# EAGLE schematic Thunderbread2 (EAGLE 7.6.0)
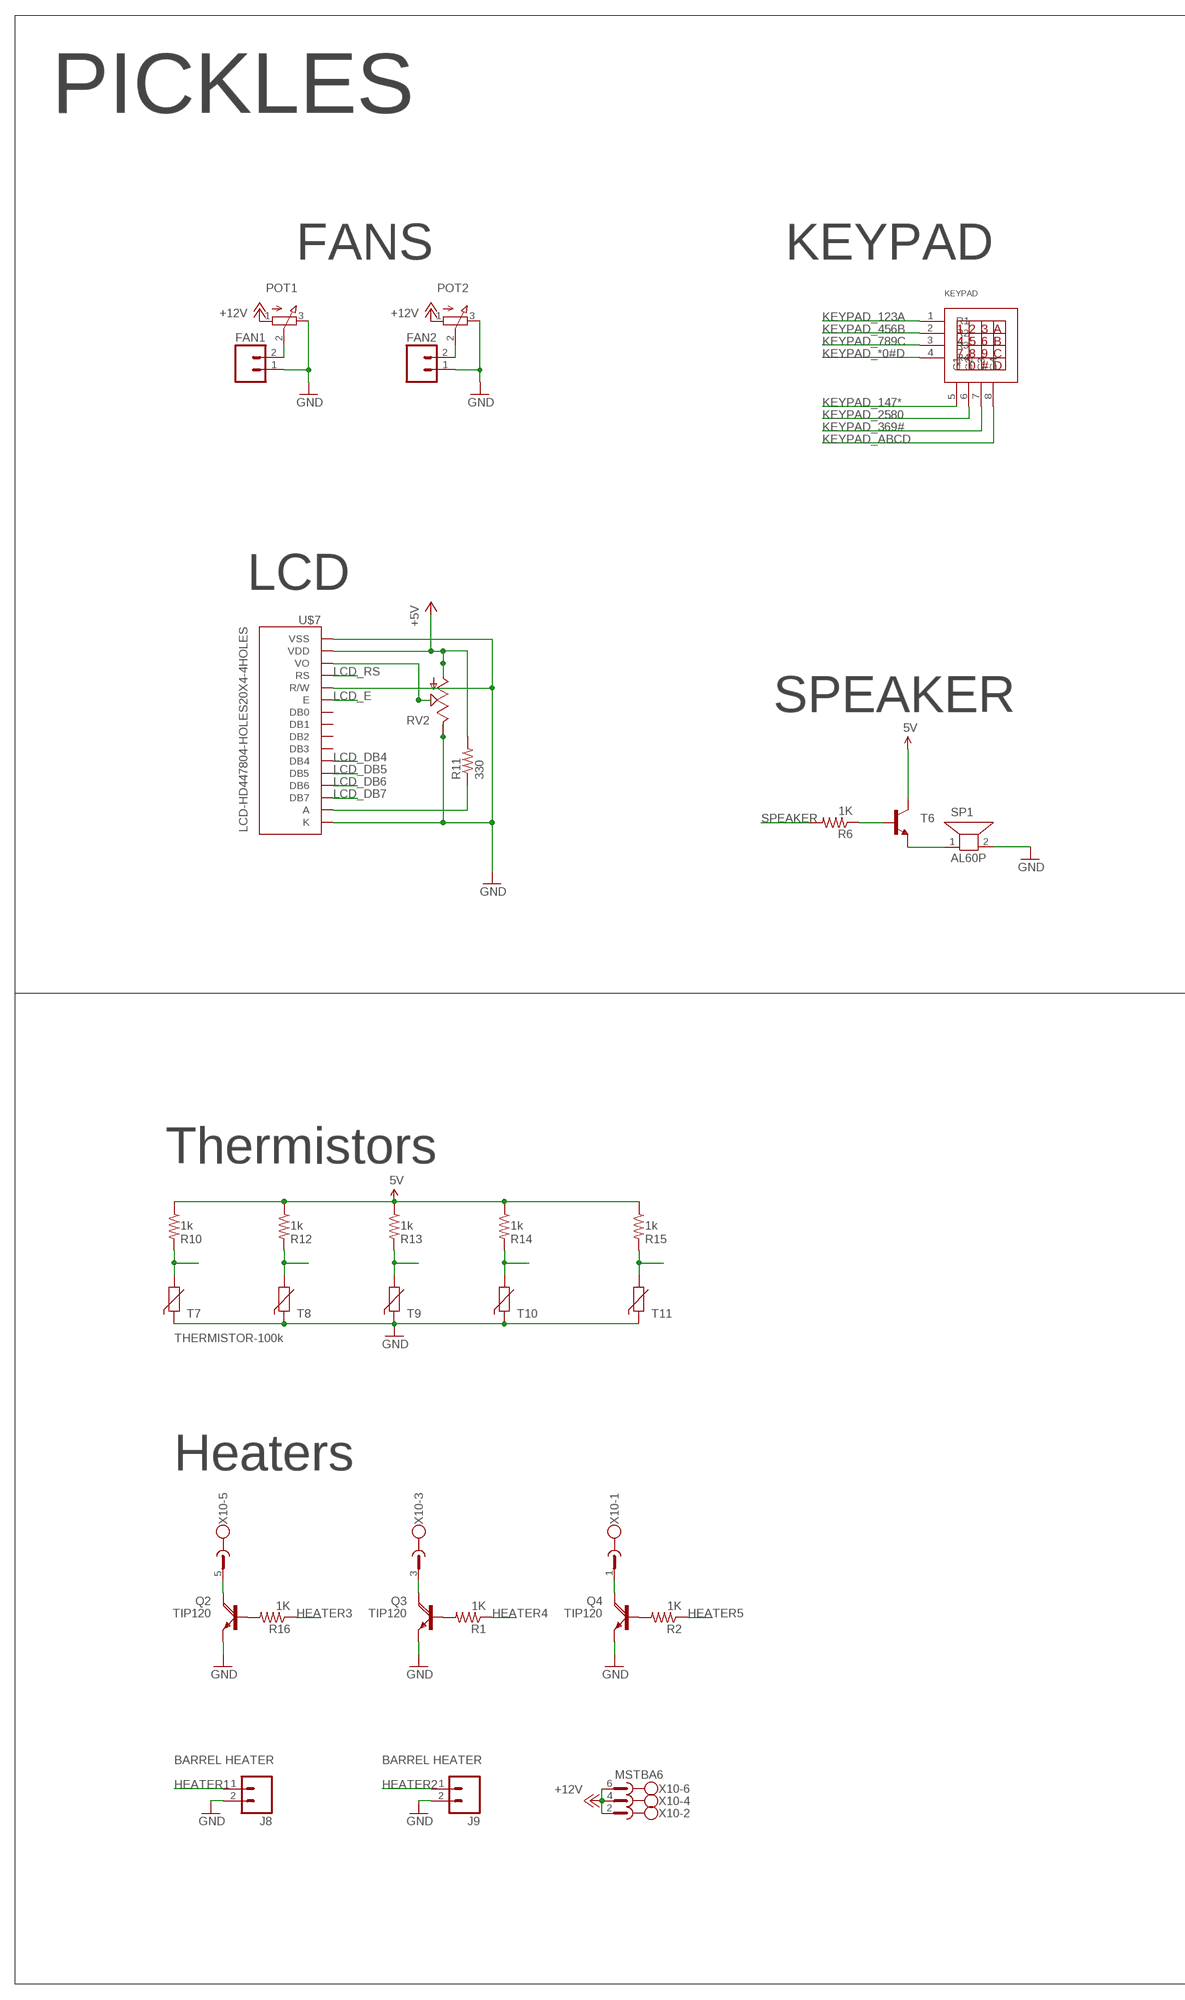
[diagram p0: schematic, sheet 1, part 1 of 3]
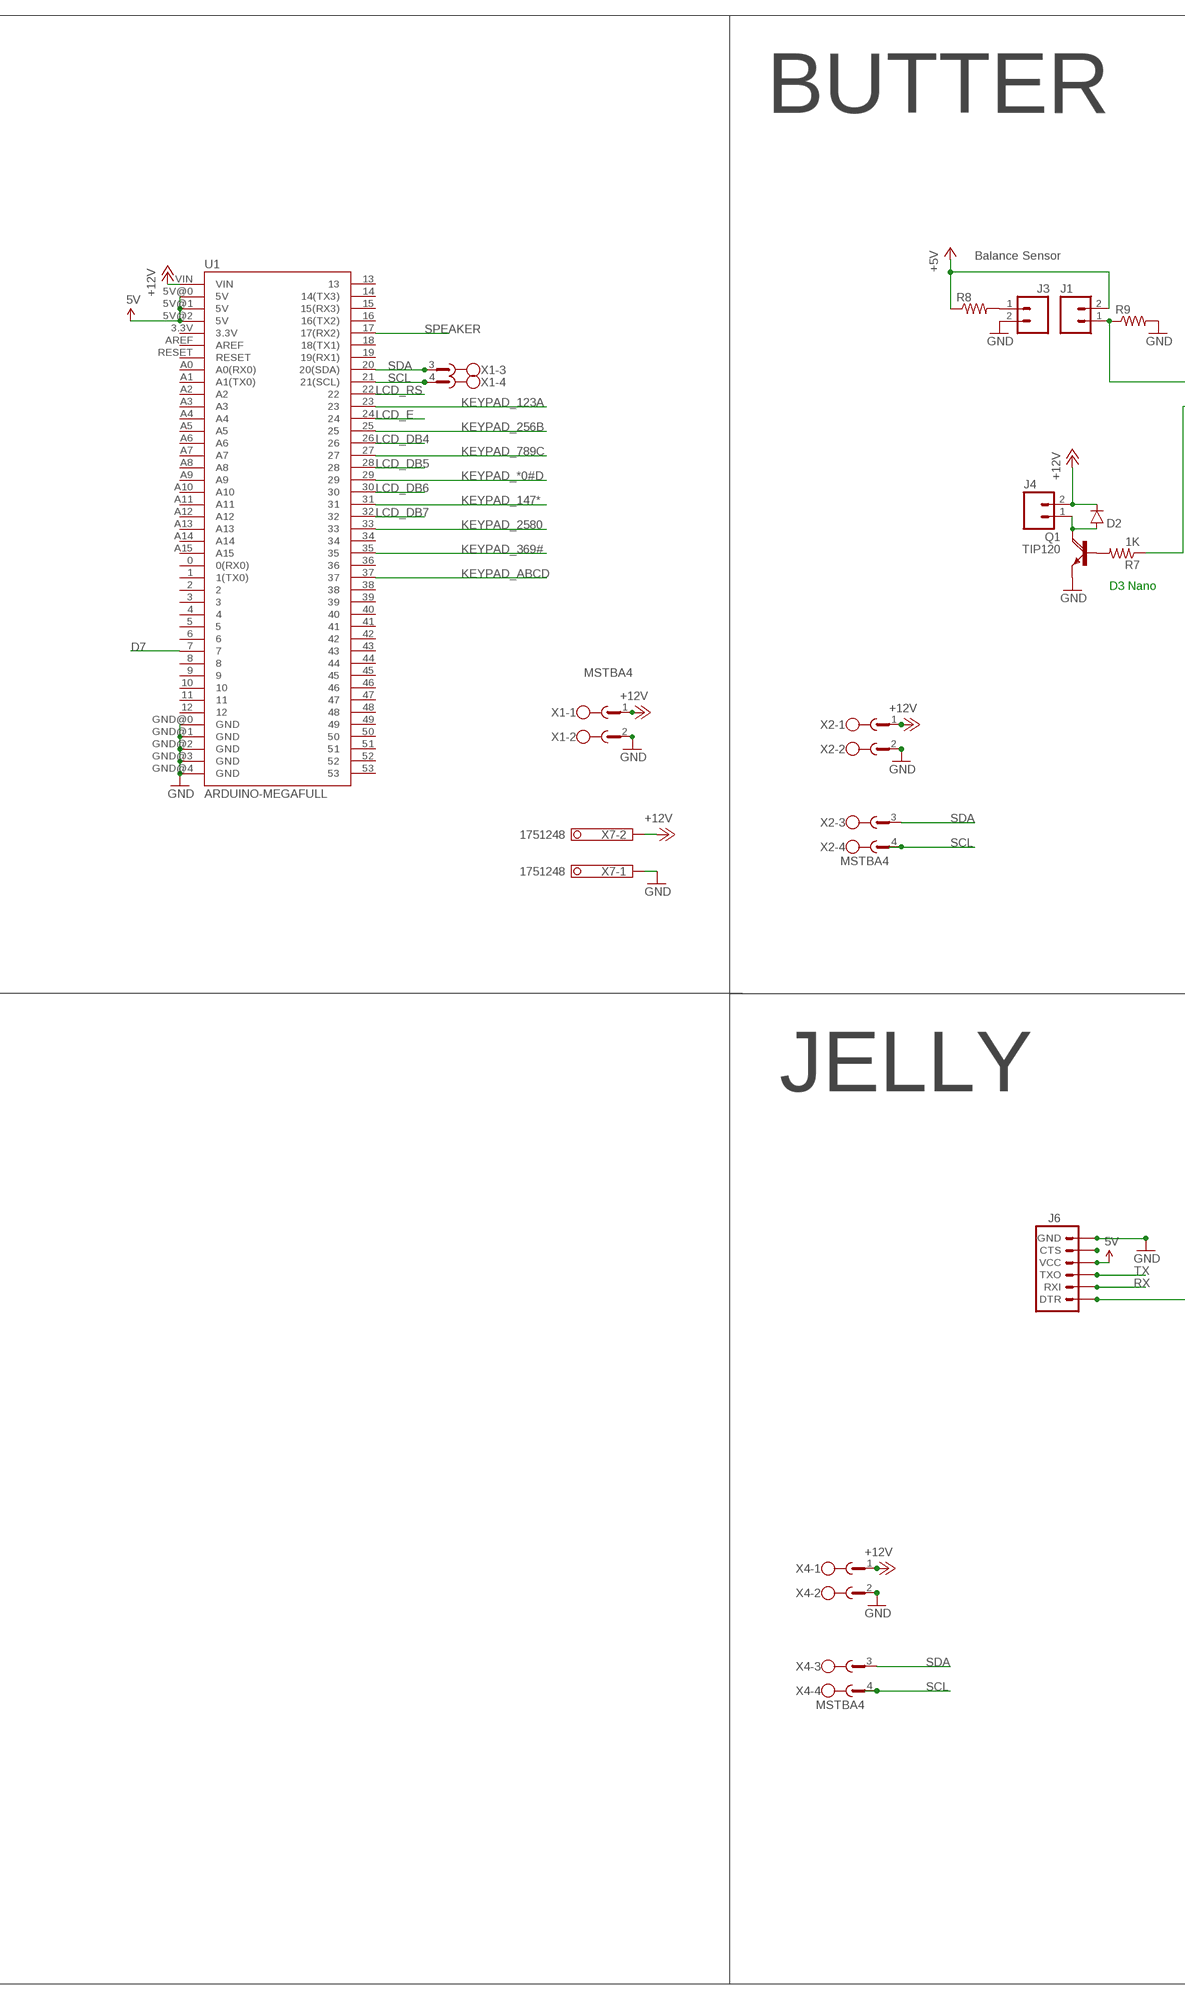
[diagram p1: schematic, sheet 1, part 2 of 3]
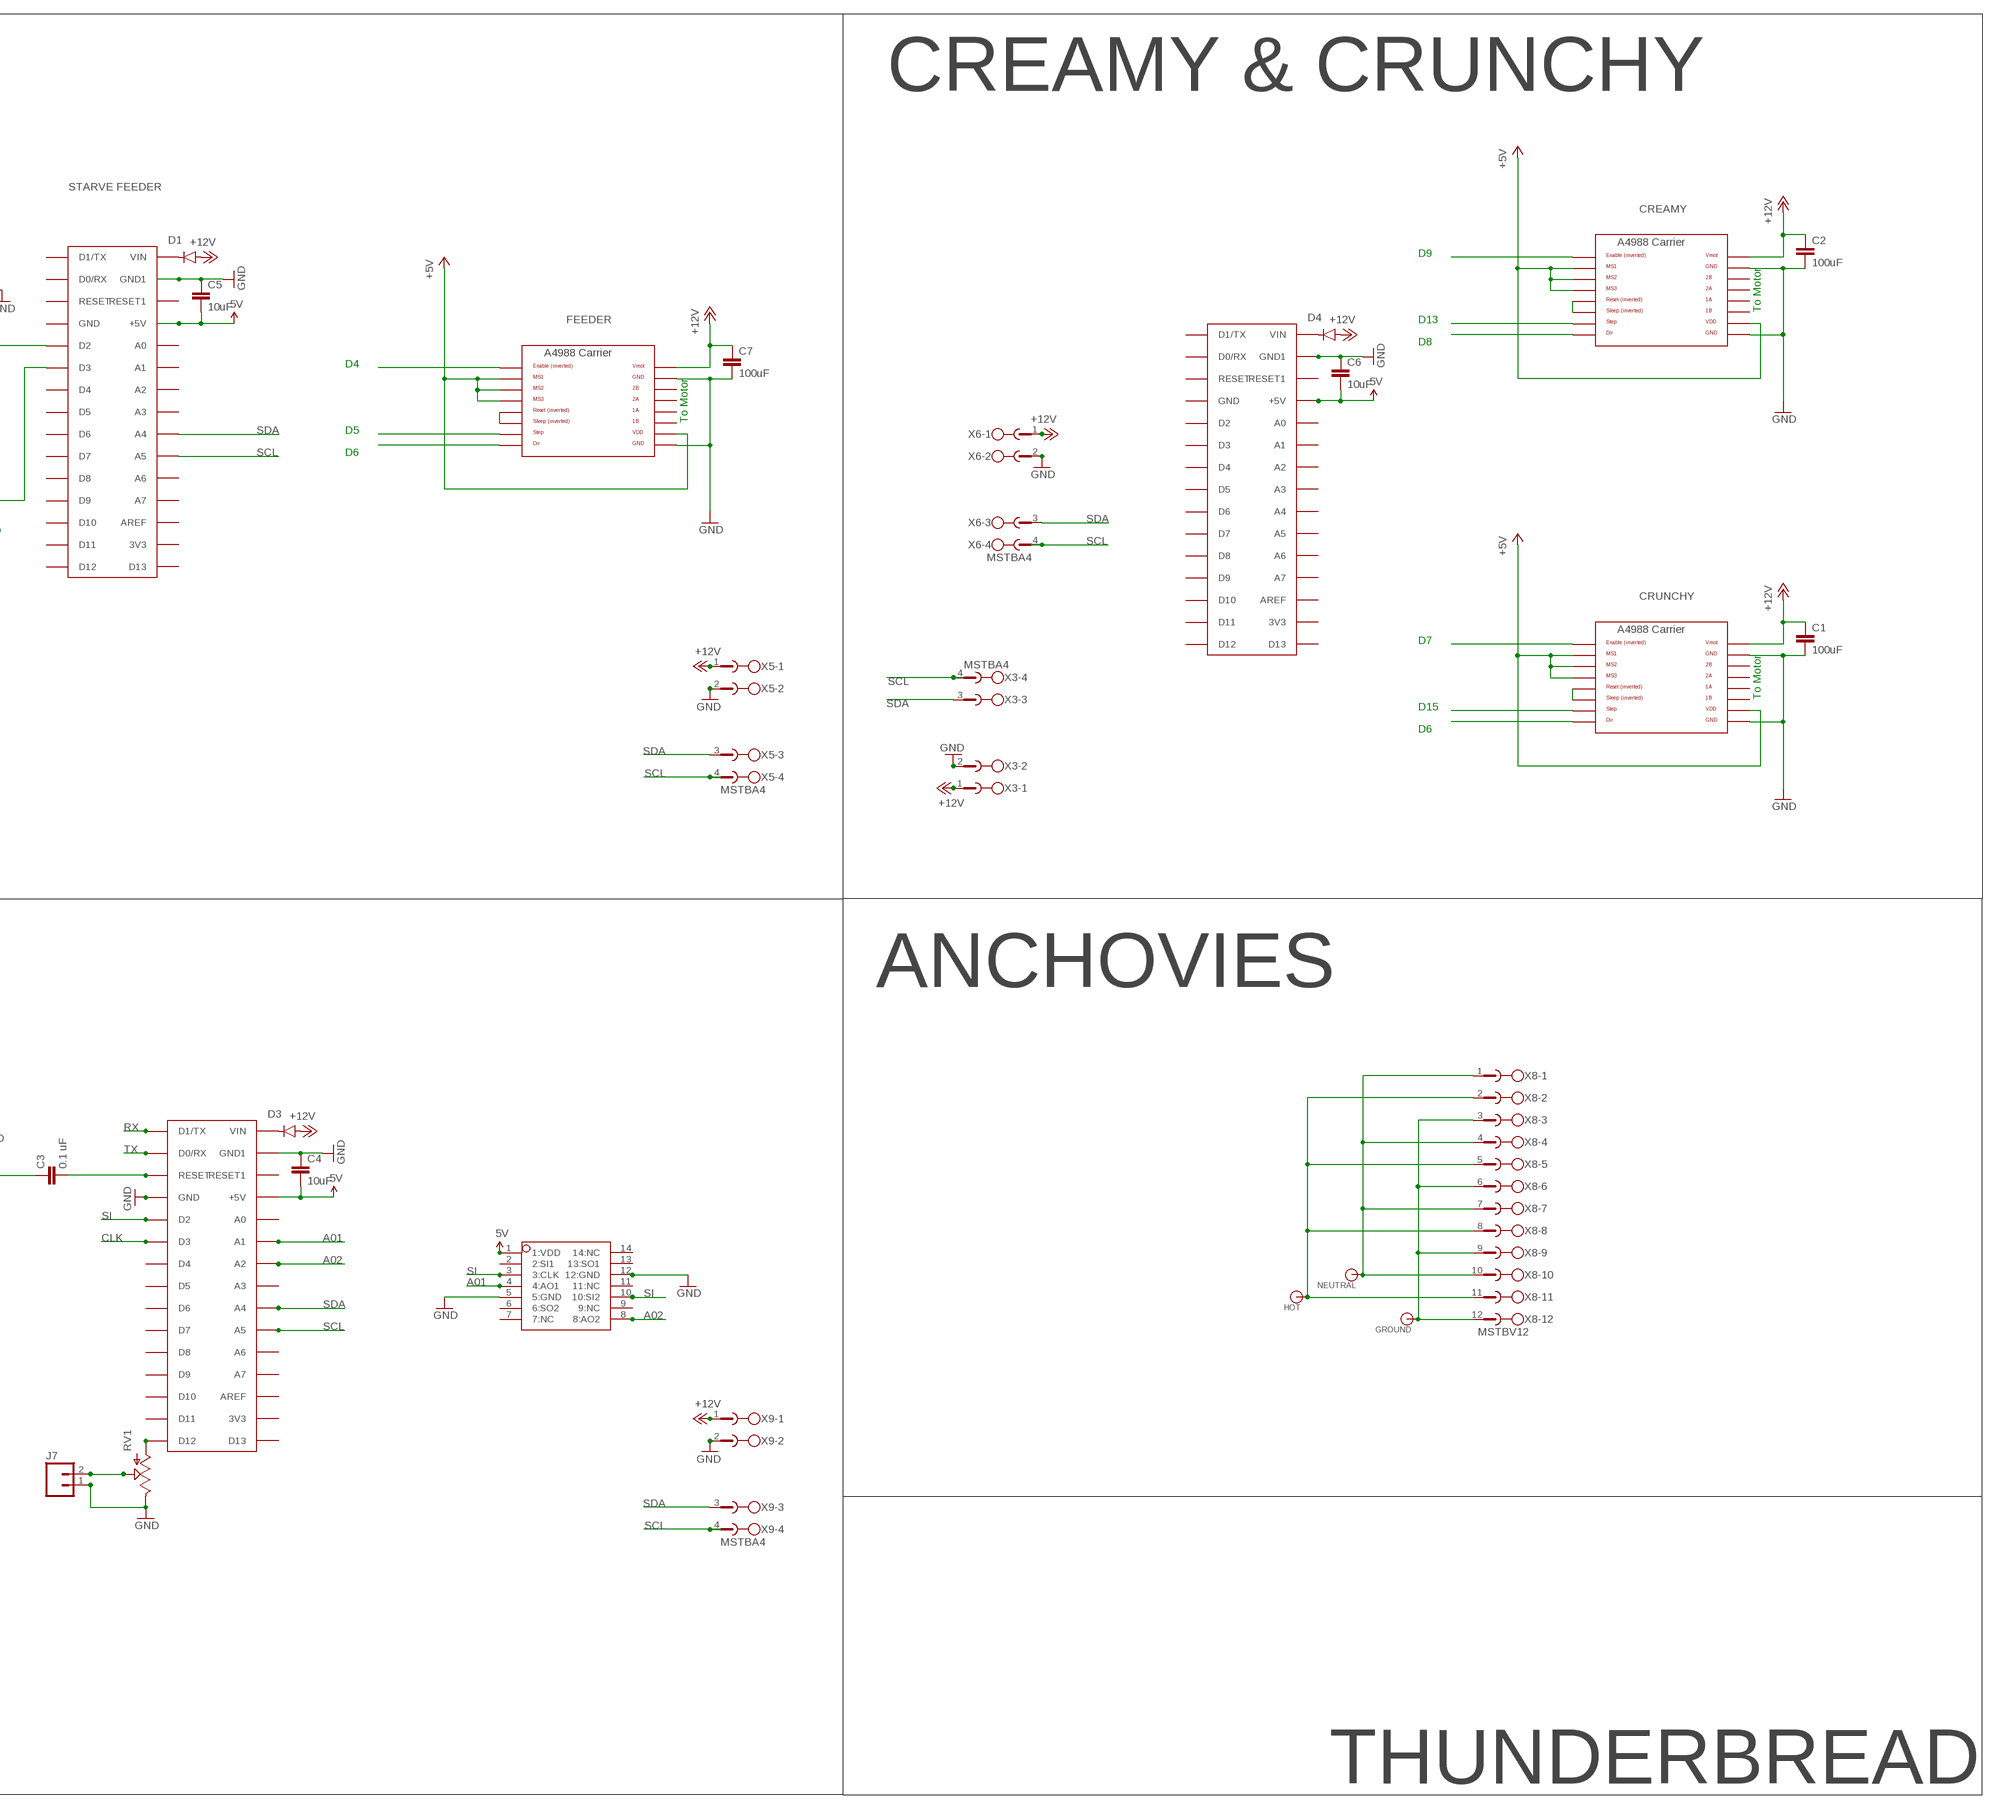
[diagram p2: schematic, sheet 1, part 3 of 3]

## Parts
C1  100uF  100UF6.3V20%(1210)  [1210]
C2  100uF  100UF6.3V20%(1210)  [1210]
C3  0.1 uF  0.1UF-50V-20%(PTH)KIT-EZ  [CAP-PTH-SMALL-KIT]
C4  10uF  10UF-6.3V-20%(1206)  [1206]
C5  10uF  10UF-6.3V-20%(1206)  [1206]
C6  10uF  10UF-6.3V-20%(1206)  [1206]
C7  100uF  100UF6.3V20%(1210)  [1210]
D1  DIODESMA  [SMA-DIODE]
D2  DIODESMA  [SMA-DIODE]
D3  DIODESMA  [SMA-DIODE]
D4  DIODESMA  [SMA-DIODE]
FAN1  M02LOCK_LONGPADS  [1X02_LOCK_LONGPADS]
FAN2  M02LOCK_LONGPADS  [1X02_LOCK_LONGPADS]
GROUND  BANANA_CONN  [BANANA_CONN]
HOT  BANANA_CONN  [BANANA_CONN]
J1  M02LOCK  [1X02_LOCK]
J3  M02LOCK  [1X02_LOCK]
J4  M02LOCK  [1X02_LOCK]
J6  ARDUINO_SERIAL_PROGRAMLOCK  [1X06_LOCK]
J7  M02LOCK  [1X02_LOCK]
J8  M02LOCK  [1X02_LOCK]
J9  M02LOCK  [1X02_LOCK]
KEYPAD  KEYPAD4X4  [KEYPAD4X4]
NEUTRAL  BANANA_CONN  [BANANA_CONN]
POT1  3RP/1610N  [3RP/1610N]
POT2  3RP/1610N  [3RP/1610N]
Q1  TIP120  [TO220AH]
Q2  TIP120  [TO220AH]
Q3  TIP120  [TO220AH]
Q4  TIP120  [TO220AH]
R1  1K  RESISTORAXIAL-0.3  [AXIAL-0.3]
R2  1K  RESISTORAXIAL-0.3  [AXIAL-0.3]
R6  1K  RESISTORAXIAL-0.3  [AXIAL-0.3]
R7  1K  RESISTORAXIAL-0.3  [AXIAL-0.3]
R8  RESISTOR1206  [1206]
R9  RESISTOR1206  [1206]
R10  1k  RESISTOR1206  [1206]
R11  330  RESISTOR1206  [1206]
R12  1k  RESISTOR1206  [1206]
R13  1k  RESISTOR1206  [1206]
R14  1k  RESISTOR1206  [1206]
R15  1k  RESISTOR1206  [1206]
R16  1K  RESISTORAXIAL-0.3  [AXIAL-0.3]
RV1  POTTRIM  [TRIM_POT]
RV2  POTTRIM  [TRIM_POT]
SP1  AL60P  [AL60P]
T6  TRANSISTOR_NPNBC547  [TO-92-AMMO]
T7  THERMISTOR-100k  THERMISTOR-2,5  [RS-2,5]
T8  THERMISTOR-100k  THERMISTOR-2,5  [RS-2,5]
T9  THERMISTOR-100k  THERMISTOR-2,5  [RS-2,5]
T10  THERMISTOR-100k  THERMISTOR-2,5  [RS-2,5]
T11  THERMISTOR-100k  THERMISTOR-2,5  [RS-2,5]
U1  ARDUINO-MEGAFULL  [ARDUINO_MEGA]
U$1  ARDUINONANO  [PDIP-32]
U$2  ARDUINONANO  [PDIP-32]
U$3  POLOLU_A4983CARRIER  [A4988BREAKOUT]
U$4  POLOLU_A4983CARRIER  [A4988BREAKOUT]
U$5  TSL1402R  [TSL1402R]
U$6  POLOLU_A4983CARRIER  [A4988BREAKOUT]
U$7  LCD-HD447804-HOLES20X4-4HOLES  [LCD-20X4-4HOLES]
U$8  ARDUINONANO  [PDIP-32]
X1  MSTBA4  [MSTBA4]
X2  MSTBA4  [MSTBA4]
X3  MSTBA4  [MSTBA4]
X4  MSTBA4  [MSTBA4]
X5  MSTBA4  [MSTBA4]
X6  MSTBA4  [MSTBA4]
X7  1751248  [1751248]
X8  MSTBV12  [MSTBV12]
X9  MSTBA4  [MSTBA4]
X10  MSTBA6  [MSTBA6]

## Nets
5V: C4.2 C5.2 C6.2 J6.4(VCC) R10.1 R12.1 R13.1 R14.1 R15.1 T6.1(C) U1.5V@0(5V) U1.5V@1(5V) U1.5V@2(5V) U$1.+5V U$2.+5V U$5.1(1:VDD) U$8.+5V
+5V: J1.2 R8.1 R11.2 RV2.3(A) U$3.MS1 U$3.MS2 U$3.MS3 U$3.VDD U$4.MS1 U$4.MS2 U$4.MS3 U$4.VDD U$6.MS1 U$6.MS2 U$6.MS3 U$6.VDD U$7.P$2(VDD)
+12V: C1.1 C2.1 C7.1 D1.A D2.C D3.A D4.A J4.2 POT1.1(A) POT2.1(A) U1.VIN U$3.VMOT U$4.VMOT U$6.VMOT X1.1 X2.1 X3.1 X4.1 X5.1 X6.1 X7.2 X9.1 X10.2 X10.4 X10.6
A01: U$1.A1 U$5.4(4:AO1)
A02: U$1.A2 U$5.8(8:AO2)
CLK: U$1.D3
D7: U1.7
GND: C1.2 C2.2 C4.1 C5.1 C6.1 C7.2 FAN1.1 FAN2.1 J3.2 J6.6(GND) J7.1 J8.2 J9.2 POT1.3(E) POT2.3(E) Q1.E Q2.E Q3.E Q4.E R9.2 RV1.2(E) RV2.2(E) SP1.2 T7.1 T8.1 T9.1 T10.1 T11.1 U1.GND@0(GND) U1.GND@1(GND) U1.GND@2(GND) U1.GND@3(GND) U1.GND@4(GND) U$1.GND U$1.GND1 U$2.GND1 U$3.GND U$3.GND@0(GND) U$4.GND U$4.GND@0(GND) U$5.5(5:GND) U$5.12(12:GND) U$6.GND U$6.GND@0(GND) U$7.P$1(VSS) U$7.P$5(R/W) U$7.P$16(K) U$8.GND1 X1.2 X2.2 X3.2 X4.2 X5.2 X6.2 X7.1 X9.2
HEATER1: J8.1
HEATER2: J9.1
HEATER3: R16.P$1
HEATER4: R1.P$1
HEATER5: R2.P$1
KEYPAD_123A: KEYPAD.1(R1) U1.23
KEYPAD_147*: KEYPAD.5(C1) U1.31
KEYPAD_256B: U1.25
KEYPAD_369#: KEYPAD.7(C3) U1.35
KEYPAD_456B: KEYPAD.2(R2)
KEYPAD_789C: KEYPAD.3(R3) U1.27
KEYPAD_2580: KEYPAD.6(C2) U1.33
KEYPAD_*0#D: KEYPAD.4(R4) U1.29
KEYPAD_ABCD: KEYPAD.8(C4) U1.37
LCD_DB4: U1.26 U$7.P$11(DB4)
LCD_DB5: U1.28 U$7.P$12(DB5)
LCD_DB6: U1.30 U$7.P$13(DB6)
LCD_DB7: U1.32 U$7.P$14(DB7)
LCD_E: U1.24 U$7.P$6(E)
LCD_RS: U1.22 U$7.P$4(RS)
N$2: Q2.C X10.5
N$3: Q3.B R1.P$2
N$5: Q3.C X10.3
N$6: J3.1 R8.2
N$7: J1.1 R9.1 U$2.D2
N$8: D2.A J4.1 Q1.C
N$9: R7.P$1 U$2.D3
N$10: Q1.B R7.P$2
N$11: FAN1.2 POT1.2(S)
N$12: FAN2.2 POT2.2(S)
N$13: X1.3
N$14: X1.4
N$15: D1.C U$2.VIN
N$16: C3.2 U$1.RESET
N$17: U$3.RST U$3.SLP(SLEEP)
N$18: U$3.STEP
N$19: U$3.DIR
N$20: U$3.EN
N$21: U$4.RST U$4.SLP(SLEEP)
N$22: U$4.STEP
N$23: U$4.DIR
N$24: U$4.EN
N$25: D4.C U$8.VIN
N$26: RV1.3(A) U$1.D12
N$27: J6.5(CTS)
N$28: C3.1 J6.1(DTR)
N$29: J7.2 RV1.1(S)
N$30: U$6.RST U$6.SLP(SLEEP)
N$31: R6.P$1 T6.2(B)
N$32: SP1.1 T6.3(E)
N$33: U$6.STEP
N$34: U$6.DIR
N$35: U$6.EN
N$36: HOT.P$1 X8.2 X8.5 X8.8 X8.11
N$37: NEUTRAL.P$1 X8.1 X8.4 X8.7 X8.10
N$38: GROUND.P$1 X8.3 X8.6 X8.9 X8.12
N$39: RV2.1(S) U$7.P$3(VO)
N$40: R10.2 T7.2
N$41: R12.2 T8.2
N$42: R13.2 T9.2
N$43: R14.2 T10.2
N$44: R15.2 T11.2
N$45: Q4.B R2.P$2
N$47: Q4.C X10.1
N$49: Q2.B R16.P$2
N$50: R11.1 U$7.P$15(A)
N$51: D3.C U$1.VIN
RX: J6.2(RXI) U$1.D1/TX
SCL: U1.21(21(SCL)) U$1.A5 U$2.A5 X2.4 X3.4 X4.4 X5.4 X6.4 X9.4
SDA: U1.20(20(SDA)) U$1.A4 U$2.A4 X2.3 X3.3 X4.3 X5.3 X6.3 X9.3
SI: U$1.D2 U$5.3(3:CLK) U$5.10(10:SI2)
SPEAKER: R6.P$2 U1.17(17(RX2))
TX: J6.3(TXO) U$1.D0/RX
Unconnected: U1.0(0(RX0)) U1.1(1(TX0)) U1.2 U1.3 U1.3.3V U1.4 U1.5 U1.6 U1.8 U1.9 U1.10 U1.11 U1.12 U1.13 U1.14(14(TX3)) U1.15(15(RX3)) U1.16(16(TX2)) U1.18(18(TX1)) U1.19(19(RX1)) U1.34 U1.36 U1.38 U1.39 U1.40 U1.41 U1.42 U1.43 U1.44 U1.45 U1.46 U1.47 U1.48 U1.49 U1.50 U1.51 U1.52 U1.53 U1.A0(A0(RX0)) U1.A1(A1(TX0)) U1.A2 U1.A3 U1.A4 U1.A5 U1.A6 U1.A7 U1.A8 U1.A9 U1.A10 U1.A11 U1.A12 U1.A13 U1.A14 U1.A15 U1.AREF U1.RESET U$1.3V3 U$1.A0 U$1.A3 U$1.A6 U$1.A7 U$1.AREF U$1.D4 U$1.D5 U$1.D6 U$1.D7 U$1.D8 U$1.D9 U$1.D10 U$1.D11 U$1.D13 U$1.RESET1 U$2.3V3 U$2.A0 U$2.A1 U$2.A2 U$2.A3 U$2.A6 U$2.A7 U$2.AREF U$2.D0/RX U$2.D1/TX U$2.D4 U$2.D5 U$2.D6 U$2.D7 U$2.D8 U$2.D9 U$2.D10 U$2.D11 U$2.D12 U$2.D13 U$2.GND U$2.RESET U$2.RESET1 U$3.1A U$3.1B U$3.2A U$3.2B U$4.1A U$4.1B U$4.2A U$4.2B U$5.2(2:SI1) U$5.6(6:SO2) U$5.7(7:NC) U$5.9(9:NC) U$5.11(11:NC) U$5.13(13:SO1) U$5.14(14:NC) U$6.1A U$6.1B U$6.2A U$6.2B U$7.P$7(DB0) U$7.P$8(DB1) U$7.P$9(DB2) U$7.P$10(DB3) U$8.3V3 U$8.A0 U$8.A1 U$8.A2 U$8.A3 U$8.A4 U$8.A5 U$8.A6 U$8.A7 U$8.AREF U$8.D0/RX U$8.D1/TX U$8.D2 U$8.D3 U$8.D4 U$8.D5 U$8.D6 U$8.D7 U$8.D8 U$8.D9 U$8.D10 U$8.D11 U$8.D12 U$8.D13 U$8.GND U$8.RESET U$8.RESET1

## Notes on the sheet
- PICKLES | BUTTER | CREAMY & CRUNCHY
- STARVE FEEDER
- CREAMY
- FANS | KEYPAD | Balance Sensor
- D9
- To Motor
- FEEDER | D13
- D8
- D4
- To Motor
- D5
- D6
- LCD | D3 Nano
- CRUNCHY
- SPEAKER | D7
- To Motor
- D15
- D6
- JELLY | ANCHOVIES
- Thermistors
- Heaters
- BARREL HEATER | BARREL HEATER
- THUNDERBREAD

## Library data of the parts
C1 C2 C7 = SparkFun-Capacitors:100UF6.3V20%(1210): CAP-09827; PROD_ID: CAP-09827
C3 = SparkFun-Capacitors:0.1UF-50V-20%(PTH): CAP-08370; PROD_ID: CAP-08370
C4-C6 = SparkFun-Capacitors:10UF-6.3V-20%(1206): CAP-10057 Ceramic; PROD_ID: CAP-10057
D1-D4 = SparkFun-DiscreteSemi:DIODE: Diode These are standard reverse protection diodes and small signal diodes. SMA package can handle up to about 1A. SOD-323 can handle about 200mA. What the SOD-323 package when ordering, there are some mfgs out there that are 5-pin packages.
FAN1 FAN2 J1 J3 J4 J7-J9 = SparkFun-Connectors:M02: Standard 2-pin 0.1" header. Use with - straight break away headers ( PRT-00116) - right angle break away headers (PRT-00553) - swiss pins (PRT-00743) - machine pins (PRT-00117) - female headers (PRT-00115) Molex polarized connector foot print use with: PRT-08233 with associated crimp pins and housings. 2.54_SCREWTERM for use with PRT-10571. 3.5mm Screw Terminal footprints for PRT-08084 5mm Screw Terminal footprints for use with PRT-08432
GROUND HOT NEUTRAL = SparkFun-Connectors:BANANA_CONN: Through-hole banana jack
J6 = SparkFun-Connectors:ARDUINO_SERIAL_PROGRAM: FTDI connector footprints
KEYPAD = keypad4x4_ece:KEYPAD4X4
POT1 POT2 = pot:3RP/1610N: 16mm Potentiometer one level Source: http://www.alphapotentiometers.net/html/16mm_pot_2.html
Q1-Q4 = transistor-power:TIP120: NPN DARLINGTON TRANSISTOR
R1 R2 R6-R16 = SparkFun-Passives:RESISTOR: Resistor Basic schematic elements and footprints for 0603, 1206, and PTH resistors.
RV1 RV2 = SparkFun-Electromechanical:POT
SP1 = buzzer:AL60P: SPEAKER Source: Buerklin; OC_FARNELL: unknown; OC_NEWARK: unknown
T6 = SparkFun-DiscreteSemi:TRANSISTOR_NPN: Generic NPN BJT MMBT2222A - TRANS-08049 (SOT-23, 1A 40V) MPSA42 - TRANS-09116 (SOT-23, 500mA 300V) MMBT5088LT1G - TRANS-11160 (SOT-23, 50 mA 30V) BC547 - COM-08928 <http://www.sparkfun.com/products/8928> (TO-92 45V 100mA) (1.Collector 2.Base 3.Emitter) 2N3904 - COM-00521 <http://www.sparkfun.com/products/521> (TO-92 40V 200mA) (1.Emitter 2.Base 3.Collector) P2N2222A - COM-12852 <http://www.sparkfun.com/products/12852> (TO-92 40V 600mA) (1.Collector 2.Base 3.Emitter)
T7-T11 = varistor:THERMISTOR: THERMISTOR
U1 = SparkFun-Boards:ARDUINO-MEGA: Arduino Mega board footprint
U$1 U$2 U$8 = jet-lib:ARDUINONANO
U$3 U$4 U$6 = RepRapjr(1):POLOLU_A4983CARRIER
U$5 = 1dah:TSL1402R: 256 pixel linear photodiode array
U$7 = HD44780LCD:LCD-HD44780
X1-X6 X9 = con-phoenix-508:MSTBA4: PHOENIX; MF: FARNELL; MPN: 1757268; OC_FARNELL: 3705195; OC_NEWARK: 71C4163
X7 = con-phoenix-350:1751248: MKDS 1/ 2-3,5 Printklemme Nennstrom: 10 A Bemessungsspannung: 160 V Raster: 3,5 mm Polzahl: 2 Montageart: Löten Anschlussart: Schraubanschluss Anschlussrichtung vom Leiter zur Platine: 0° Source: http://eshop.phoenixcontact.com .. 1751248.pdf; OC_FARNELL: unknown; OC_NEWARK: unknown
X8 = con-phoenix-508:MSTBV12: PHOENIX; MPN: MSTBVA2.5/12-G-5.08; OC_FARNELL: 3705341; OC_NEWARK: 69K5694
X10 = con-phoenix-508:MSTBA6: PHOENIX; MF: FARNELL; MPN: 1757284; OC_FARNELL: 3705213; OC_NEWARK: 71C4165